# Altium schematic sheet Ryu-Plate.SchDoc
size A4; SheetNumber: 2; SheetTotal: 2
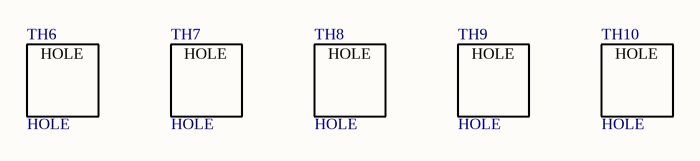
[diagram p0: Ryu-Plate.SchDoc]

## Parts
TH6  HOLE  [M2_TH_HOLE]
TH7  HOLE  [M2_TH_HOLE]
TH8  HOLE  [M2_TH_HOLE]
TH9  HOLE  [M2_TH_HOLE]
TH10  HOLE  [M2_TH_HOLE]